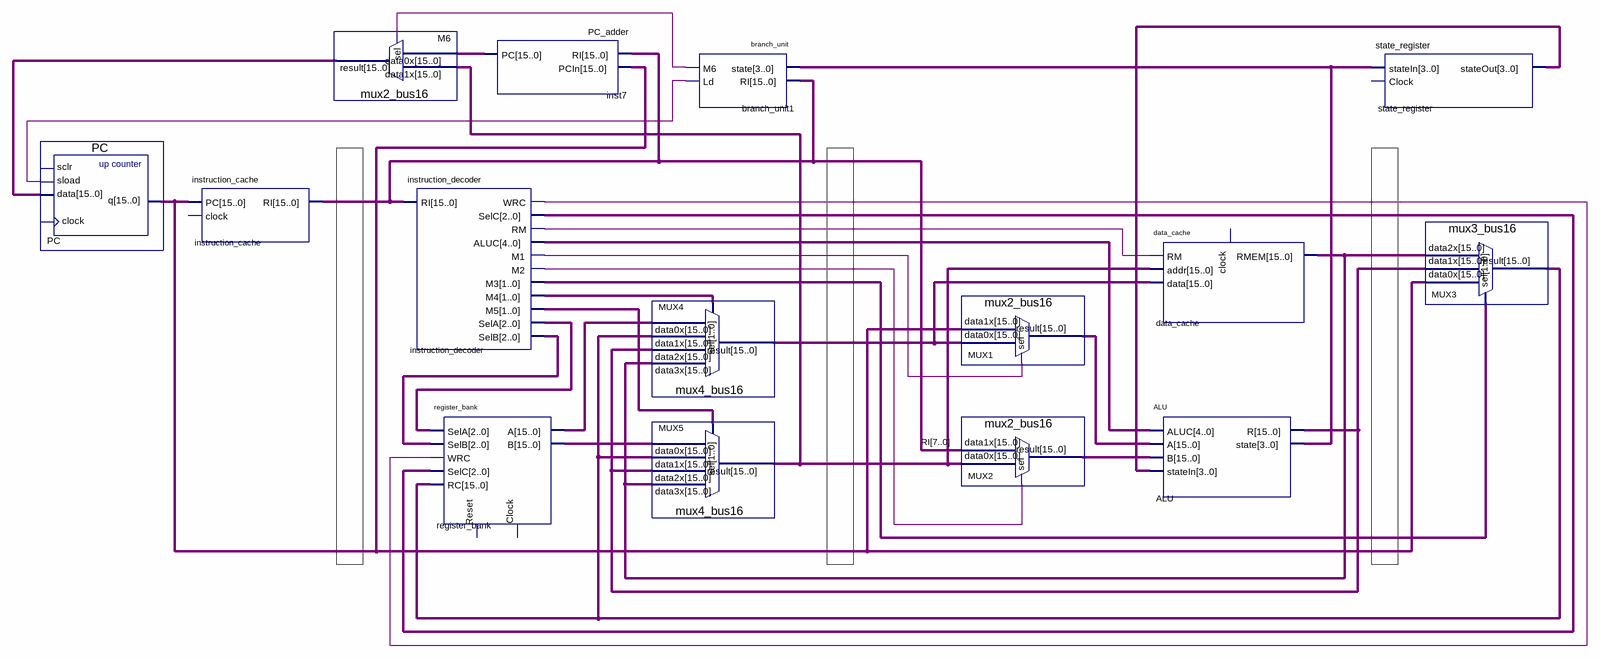
[diagram p0: schematic sheet]
// Quartus schematic P4-report.bdf as structural Verilog: 15 symbols, 0 pins
module \P4-report  (
);

  wire branch_unit1_ld, branch_unit1_m6, instruction_decoder_m1, instruction_decoder_m2,
       instruction_decoder_rm, instruction_decoder_wrc;
  wire [1:0] instruction_decoder_m3, instruction_decoder_m4, instruction_decoder_m5;
  wire [2:0] instruction_decoder_sela, instruction_decoder_selb, instruction_decoder_selc;
  wire [3:0] ALU_state, state_register_stateout;
  wire [4:0] instruction_decoder_aluc;
  wire [7:0] RI;
  wire [15:0] ALU_r, data_cache_rmem, inst7_pc, M6_result, MUX1_result, MUX2_result, MUX3_result,
       MUX4_result, MUX5_result, PC_q, register_bank_a, register_bank_b;

  PC PC (.sload(branch_unit1_ld), .data(M6_result), .q(PC_q));  // open: sclr, clock
  instruction_cache instruction_cache (.PC(PC_q), .RI(RI));  // open: clock
  mux2_bus16 M6 (.data1x(MUX5_result), .data0x(inst7_pc), .sel(branch_unit1_m6), .result(M6_result));
  instruction_decoder instruction_decoder (
    .RI(RI), .WRC(instruction_decoder_wrc), .SelC(instruction_decoder_selc), .RM(instruction_decoder_rm),
    .ALUC(instruction_decoder_aluc), .M1(instruction_decoder_m1), .M2(instruction_decoder_m2),
    .M3(instruction_decoder_m3), .M4(instruction_decoder_m4), .M5(instruction_decoder_m5),
    .SelA(instruction_decoder_sela), .SelB(instruction_decoder_selb));
  register_bank register_bank (
    .SelA(instruction_decoder_sela), .SelB(instruction_decoder_selb), .WRC(instruction_decoder_wrc),
    .SelC(instruction_decoder_selc), .RC(MUX3_result), .A(register_bank_a), .B(register_bank_b));  // open: Reset, Clock
  PC_adder inst7 (.RI(RI), .PCIn(PC_q), .PC(inst7_pc));
  mux4_bus16 MUX4 (
    .data3x(data_cache_rmem), .data2x(ALU_r), .data1x(MUX3_result), .data0x(register_bank_a),
    .sel(instruction_decoder_m4), .result(MUX4_result));
  mux4_bus16 MUX5 (
    .data3x(data_cache_rmem), .data2x(ALU_r), .data1x(MUX3_result), .data0x(register_bank_b),
    .sel(instruction_decoder_m5), .result(MUX5_result));
  branch_unit branch_unit1 (.state(ALU_state), .RI(RI), .M6(branch_unit1_m6), .Ld(branch_unit1_ld));
  mux2_bus16 MUX1 (.data1x(PC_q), .data0x(MUX4_result), .sel(instruction_decoder_m1), .result(MUX1_result));
  mux2_bus16 MUX2 (.data1x(RI), .data0x(MUX5_result), .sel(instruction_decoder_m2), .result(MUX2_result));
  data_cache data_cache (
    .RM(instruction_decoder_rm), .addr(MUX5_result), .data(MUX4_result), .RMEM(data_cache_rmem));  // open: clock
  ALU ALU (
    .ALUC(instruction_decoder_aluc), .A(MUX1_result), .B(MUX2_result), .stateIn(state_register_stateout),
    .R(ALU_r), .state(ALU_state));
  state_register state_register (.stateIn(ALU_state), .stateOut(state_register_stateout));  // open: Clock
  mux3_bus16 MUX3 (
    .data2x(data_cache_rmem), .data1x(ALU_r), .data0x(PC_q), .sel(instruction_decoder_m3),
    .result(MUX3_result));
endmodule
